# EAGLE schematic steering_wheel_V3.0 (EAGLE 6.3)

## Sheet 1 of 4
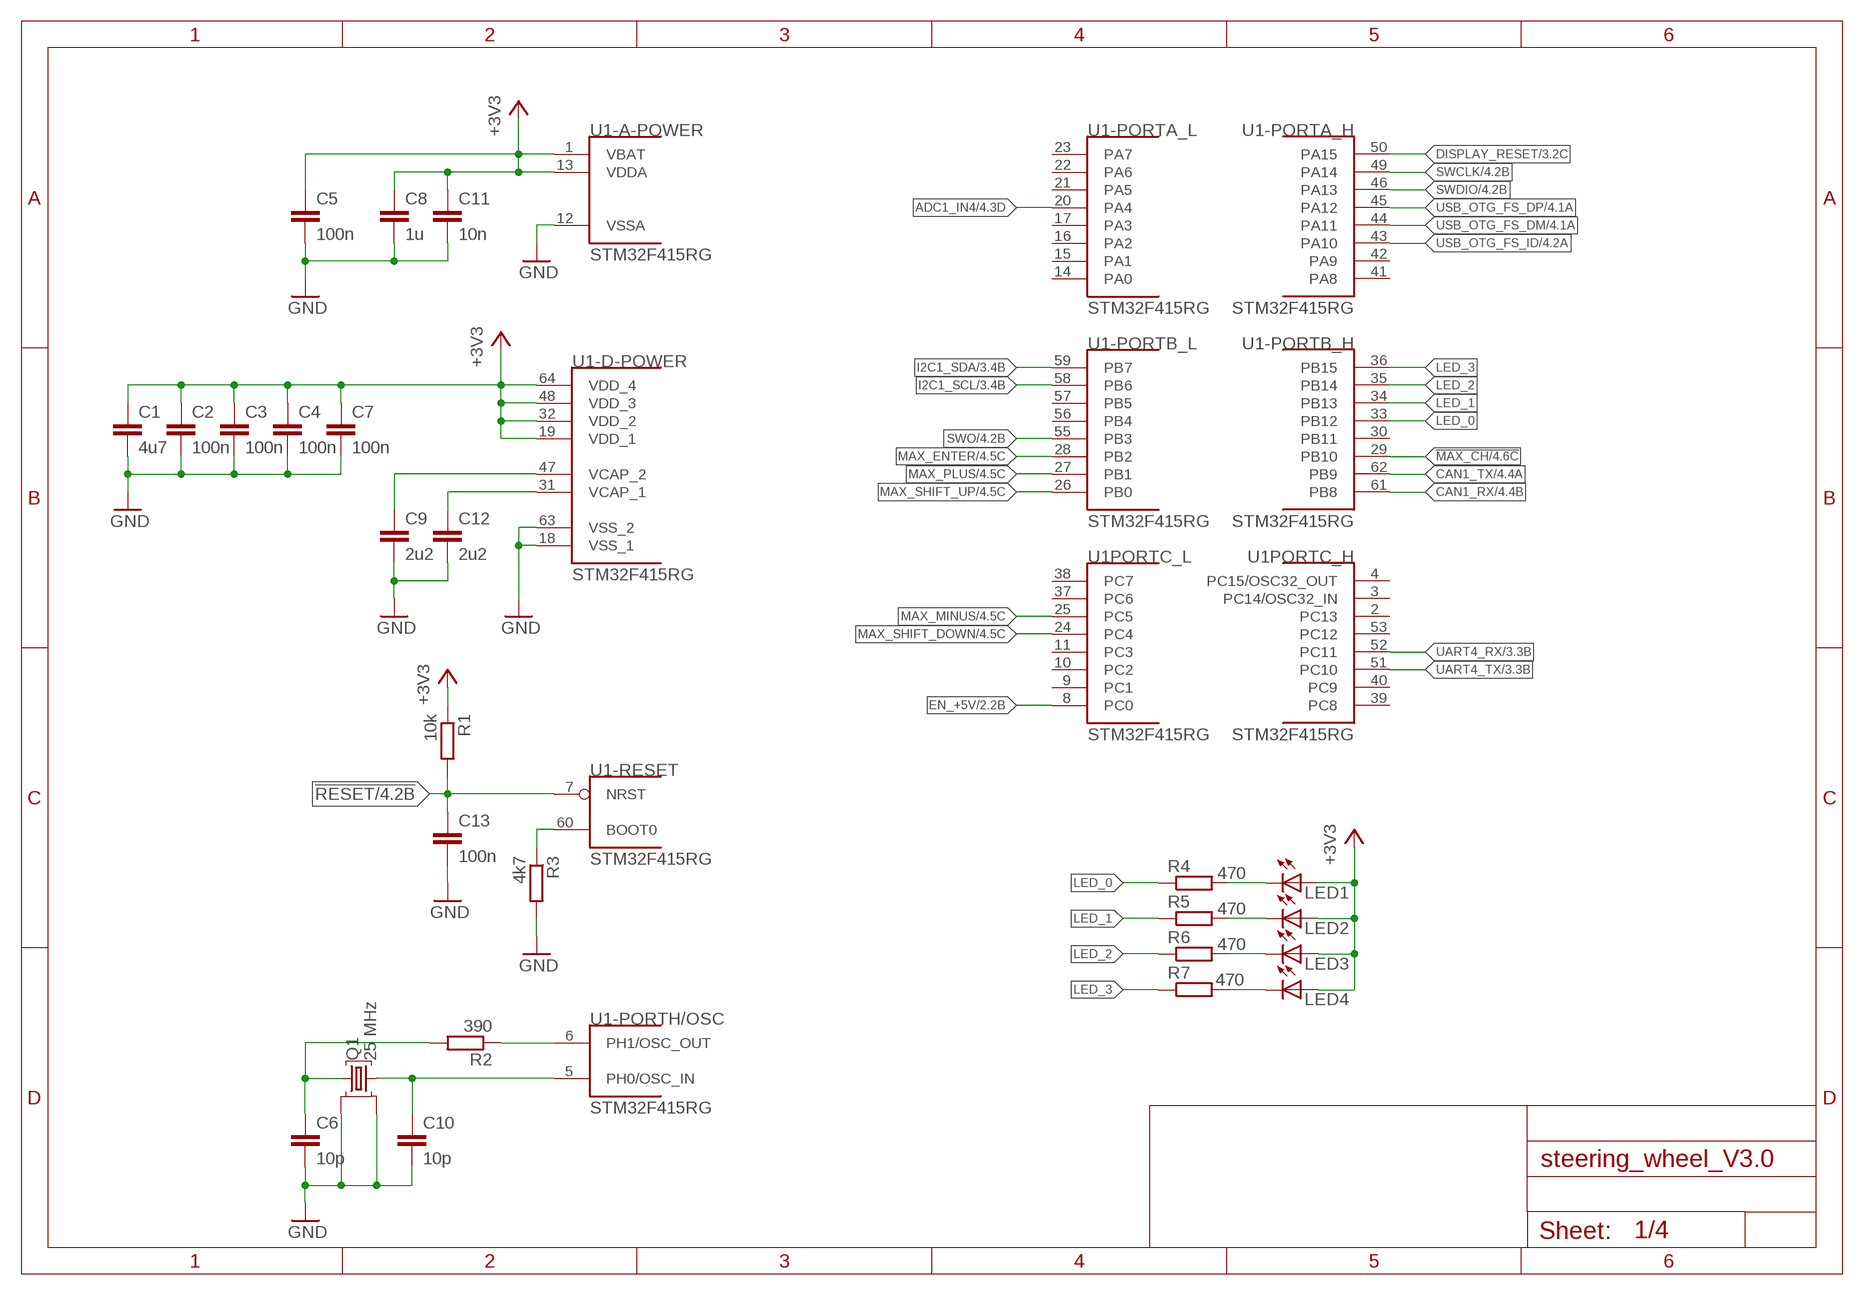
[diagram p0: schematic, sheet 1]

### Parts
C1  4u7  C-EUC0603  [C0603]
C2  100n  C-EUC0603  [C0603]
C3  100n  C-EUC0603  [C0603]
C4  100n  C-EUC0603  [C0603]
C5  100n  C-EUC0603  [C0603]
C6  10p  C-EUC0603  [C0603]
C7  100n  C-EUC0603  [C0603]
C8  1u  C-EUC0603  [C0603]
C9  2u2  C-EUC0603  [C0603]
C10  10p  C-EUC0603  [C0603]
C11  10n  C-EUC0603  [C0603]
C12  2u2  C-EUC0603  [C0603]
C13  100n  C-EUC0603  [C0603]
LED1  LEDCHIPLED_0603  [CHIPLED_0603]
LED2  LEDCHIPLED_0603  [CHIPLED_0603]
LED3  LEDCHIPLED_0603  [CHIPLED_0603]
LED4  LEDCHIPLED_0603  [CHIPLED_0603]
Q1  25 MHz  CRYSTAL2M_CX32  [3.2X2.5MM-SMD]
R1  10k  R-EU_R0603  [R0603]
R2  390  R-EU_R0603  [R0603]
R3  4k7  R-EU_R0603  [R0603]
R4  470  R-EU_R0603  [R0603]
R5  470  R-EU_R0603  [R0603]
R6  470  R-EU_R0603  [R0603]
R7  470  R-EU_R0603  [R0603]
U1  STM32F415RG  [LQFP64]

### Nets
!MAX_CH: U1.29(-PORTB_H:PB10) ; also sheet 4
!RESET: C13.1 R1.2 U1.7(-RESET:NRST) ; also sheet 4
+3V3: C1.1 C2.1 C3.1 C4.1 C5.1 C7.1 C8.1 C11.1 LED1.A LED2.A LED3.A LED4.A R1.1 U1.1(-A-POWER:VBAT) U1.13(-A-POWER:VDDA) U1.19(-D-POWER:VDD_1) U1.32(-D-POWER:VDD_2) U1.48(-D-POWER:VDD_3) U1.64(-D-POWER:VDD_4) ; also sheet 2,3,4
ADC1_IN4: U1.20(-PORTA_L:PA4) ; also sheet 4
CAN1_RX: U1.61(-PORTB_H:PB8) ; also sheet 4
CAN1_TX: U1.62(-PORTB_H:PB9) ; also sheet 4
DISPLAY_RESET: U1.50(-PORTA_H:PA15) ; also sheet 3
EN_+5V: U1.8(PORTC_L:PC0) ; also sheet 2
GND: C1.2 C2.2 C3.2 C4.2 C5.2 C6.2 C7.2 C8.2 C9.2 C10.2 C11.2 C12.2 C13.2 Q1.2(GND1) Q1.4(GND2) R3.2 U1.12(-A-POWER:VSSA) U1.18(-D-POWER:VSS_1) U1.63(-D-POWER:VSS_2) ; also sheet 2,3,4
I2C1_SCL: U1.58(-PORTB_L:PB6) ; also sheet 3
I2C1_SDA: U1.59(-PORTB_L:PB7) ; also sheet 3
LED_0: R4.1 U1.33(-PORTB_H:PB12)
LED_1: R5.1 U1.34(-PORTB_H:PB13)
LED_2: R6.1 U1.35(-PORTB_H:PB14)
LED_3: R7.1 U1.36(-PORTB_H:PB15)
MAX_ENTER: U1.28(-PORTB_L:PB2) ; also sheet 4
MAX_MINUS: U1.25(PORTC_L:PC5) ; also sheet 4
MAX_PLUS: U1.27(-PORTB_L:PB1) ; also sheet 4
MAX_SHIFT_DOWN: U1.24(PORTC_L:PC4) ; also sheet 4
MAX_SHIFT_UP: U1.26(-PORTB_L:PB0) ; also sheet 4
N$1: C9.1 U1.47(-D-POWER:VCAP_2)
N$2: C12.1 U1.31(-D-POWER:VCAP_1)
N$3: R2.1 U1.6(-PORTH/OSC:PH1/OSC_OUT)
N$4: C10.1 Q1.3(Q2) U1.5(-PORTH/OSC:PH0/OSC_IN)
N$5: LED4.C R7.2
N$6: R3.1 U1.60(-RESET:BOOT0)
N$11: LED2.C R5.2
N$12: LED3.C R6.2
N$24: C6.1 Q1.1(Q1) R2.2
N$27: LED1.C R4.2
SWCLK: U1.49(-PORTA_H:PA14) ; also sheet 4
SWDIO: U1.46(-PORTA_H:PA13) ; also sheet 4
SWO: U1.55(-PORTB_L:PB3) ; also sheet 4
UART4_RX: U1.52(PORTC_H:PC11) ; also sheet 3
UART4_TX: U1.51(PORTC_H:PC10) ; also sheet 3
USB_OTG_FS_DM: U1.44(-PORTA_H:PA11) ; also sheet 4
USB_OTG_FS_DP: U1.45(-PORTA_H:PA12) ; also sheet 4
USB_OTG_FS_ID: U1.43(-PORTA_H:PA10) ; also sheet 4
Unconnected: U1.2(PORTC_H:PC13) U1.3(PORTC_H:PC14/OSC32_IN) U1.4(PORTC_H:PC15/OSC32_OUT) U1.9(PORTC_L:PC1) U1.10(PORTC_L:PC2) U1.11(PORTC_L:PC3) U1.14(-PORTA_L:PA0) U1.15(-PORTA_L:PA1) U1.16(-PORTA_L:PA2) U1.17(-PORTA_L:PA3) U1.21(-PORTA_L:PA5) U1.22(-PORTA_L:PA6) U1.23(-PORTA_L:PA7) U1.30(-PORTB_H:PB11) U1.37(PORTC_L:PC6) U1.38(PORTC_L:PC7) U1.39(PORTC_H:PC8) U1.40(PORTC_H:PC9) U1.41(-PORTA_H:PA8) U1.42(-PORTA_H:PA9) U1.53(PORTC_H:PC12) U1.54(-PORTD:PD2) U1.56(-PORTB_L:PB4) U1.57(-PORTB_L:PB5)

## Sheet 2 of 4
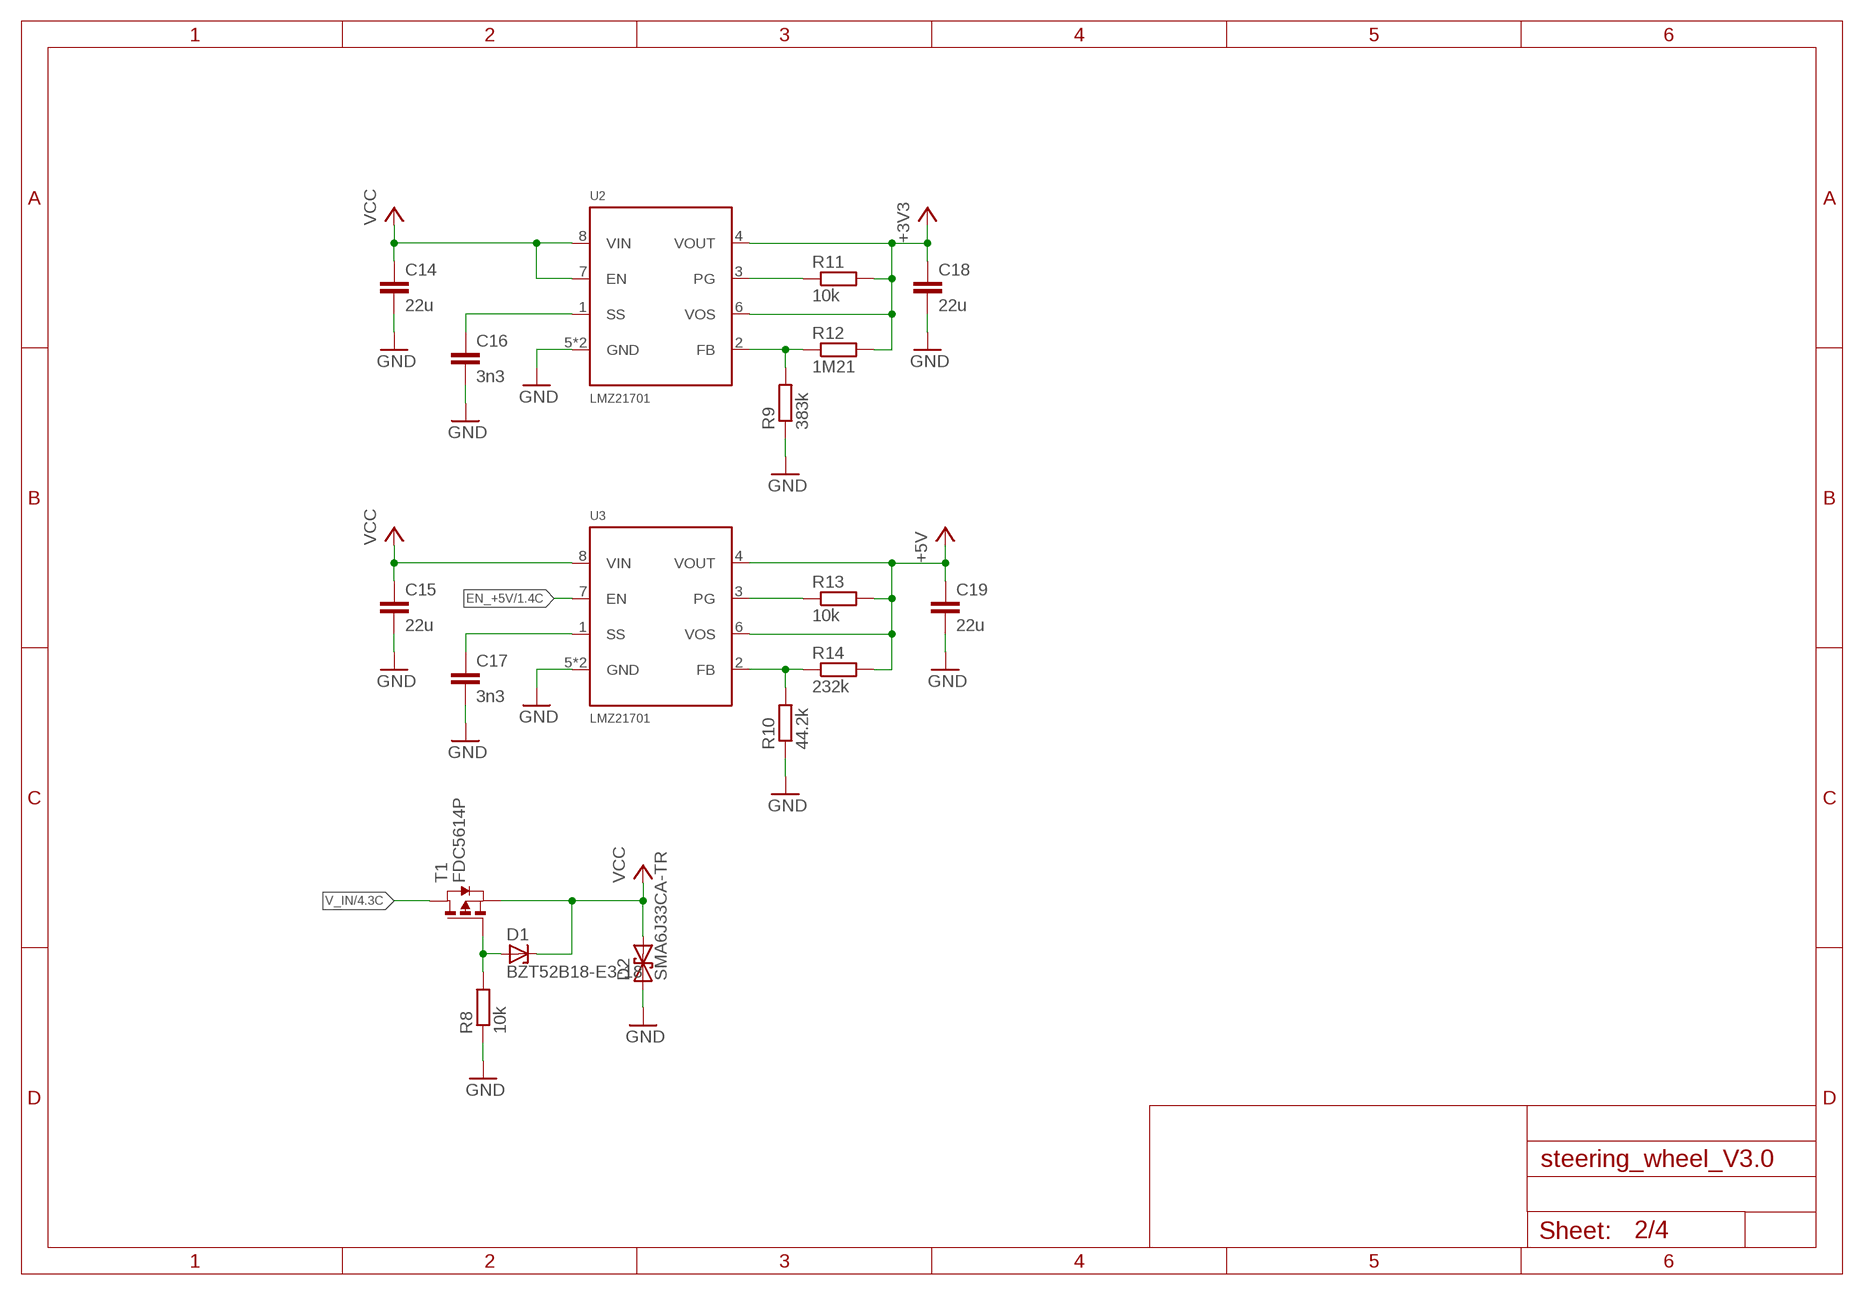
[diagram p1: schematic, sheet 2]

### Parts
C14  22u  C-EUC1210  [C1210]
C15  22u  C-EUC1210  [C1210]
C16  3n3  C-EUC0603  [C0603]
C17  3n3  C-EUC0603  [C0603]
C18  22u  C-EUC1210  [C1210]
C19  22u  C-EUC1210  [C1210]
D1  BZT52B18-E3-18  ZENER_SOD123  [SOD123F]
D2  SMA6J33CA-TR  [DO214AC]
R8  10k  R-EU_R0603  [R0603]
R9  383k  R-EU_R0603  [R0603]
R10  44.2k  R-EU_R0603  [R0603]
R11  10k  R-EU_R0603  [R0603]
R12  1M21  R-EU_R0603  [R0603]
R13  10k  R-EU_R0603  [R0603]
R14  232k  R-EU_R0603  [R0603]
T1  FDC5614P  [SSOT6]
U2  LMZ21701  [SIL0008E]
U3  LMZ21701  [SIL0008E]

### Nets
+3V3: C18.1 R11.2 R12.2 U2.4(VOUT) U2.6(VOS) ; also sheet 1,3,4
+5V: C19.1 R13.2 R14.2 U3.4(VOUT) U3.6(VOS) ; also sheet 4
EN_+5V: U3.7(EN) ; also sheet 1
GND: C14.2 C15.2 C16.2 C17.2 C18.2 C19.2 D2.A R8.1 R9.1 R10.1 U2.5(GND) U2.PAD(GND) U3.5(GND) U3.PAD(GND) ; also sheet 1,3,4
N$14: D1.A R8.2 T1.3(G)
N$38: C16.1 U2.1(SS)
N$39: C17.1 U3.1(SS)
N$40: R13.1 U3.3(PG)
N$41: R11.1 U2.3(PG)
N$42: R9.2 R12.1 U2.2(FB)
N$43: R10.2 R14.1 U3.2(FB)
V_IN: T1.1(D) T1.2(D) T1.5(D) T1.6(D) ; also sheet 4
VCC: C14.1 C15.1 D1.C D2.C T1.4(S) U2.7(EN) U2.8(VIN) U3.8(VIN)

## Sheet 3 of 4
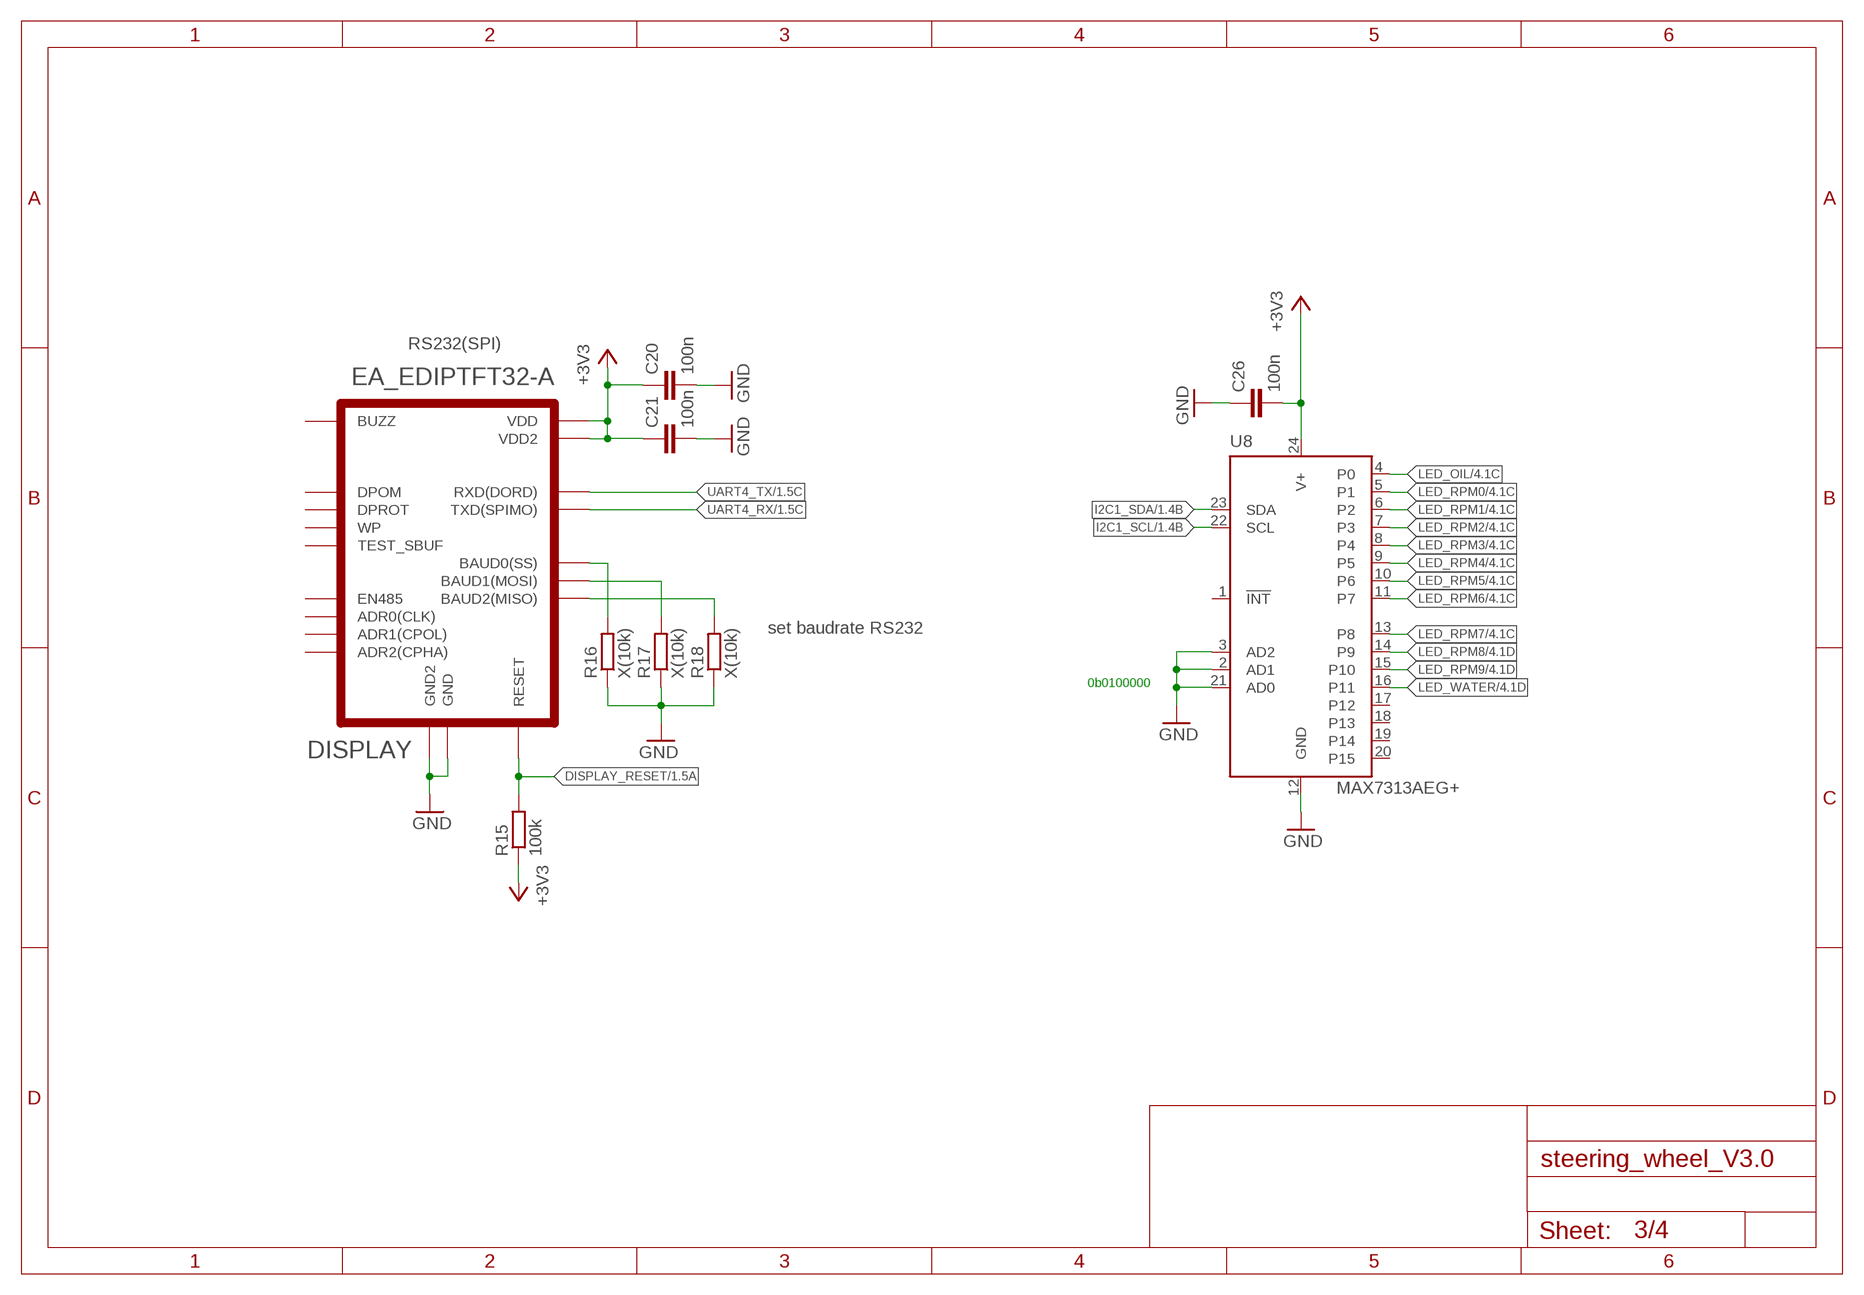
[diagram p2: schematic, sheet 3]

### Parts
C20  100n  C-EUC0603  [C0603]
C21  100n  C-EUC0603  [C0603]
C26  100n  C-EUC0603  [C0603]
DISPLAY  EA_EDIPTFT32-A  EA_EDIPTFT32-A-SR232  [EDIPTFT32-A]
R15  100k  R-EU_R0603  [R0603]
R16  X(10k)  R-EU_R0603  [R0603]
R17  X(10k)  R-EU_R0603  [R0603]
R18  X(10k)  R-EU_R0603  [R0603]
U8  MAX7313AEG+  [QSOP-24]

### Nets
+3V3: C20.1 C21.1 C26.2 DISPLAY.P$2(VDD) DISPLAY.P$22(VDD2) R15.1 U8.24(V+) ; also sheet 1,2,4
DISPLAY_RESET: DISPLAY.P$5(RESET) R15.2 ; also sheet 1
GND: C20.2 C21.2 C26.1 DISPLAY.P$1(GND) DISPLAY.P$21(GND2) R16.1 R17.1 R18.1 U8.2(AD1) U8.3(AD2) U8.12(GND) U8.21(AD0) ; also sheet 1,2,4
I2C1_SCL: U8.22(SCL) ; also sheet 1
I2C1_SDA: U8.23(SDA) ; also sheet 1
LED_OIL: U8.4(P0) ; also sheet 4
LED_RPM0: U8.5(P1) ; also sheet 4
LED_RPM1: U8.6(P2) ; also sheet 4
LED_RPM2: U8.7(P3) ; also sheet 4
LED_RPM3: U8.8(P4) ; also sheet 4
LED_RPM4: U8.9(P5) ; also sheet 4
LED_RPM5: U8.10(P6) ; also sheet 4
LED_RPM6: U8.11(P7) ; also sheet 4
LED_RPM7: U8.13(P8) ; also sheet 4
LED_RPM8: U8.14(P9) ; also sheet 4
LED_RPM9: U8.15(P10) ; also sheet 4
LED_WATER: U8.16(P11) ; also sheet 4
N$8: DISPLAY.P$8(BAUD2(MISO)) R18.2
N$10: DISPLAY.P$7(BAUD1(MOSI)) R17.2
N$13: DISPLAY.P$6(BAUD0(SS)) R16.2
UART4_RX: DISPLAY.P$11(TXD(SPIMO)) ; also sheet 1
UART4_TX: DISPLAY.P$10(RXD(DORD)) ; also sheet 1
Unconnected: DISPLAY.P$9(ADR0(CLK)) DISPLAY.P$12(EN485) DISPLAY.P$13(DPOM) DISPLAY.P$14(ADR1(CPOL)) DISPLAY.P$15(ADR2(CPHA)) DISPLAY.P$16(BUZZ) DISPLAY.P$17(DPROT) DISPLAY.P$19(WP) DISPLAY.P$20(TEST_SBUF) U8.1(!INT) U8.17(P12) U8.18(P13) U8.19(P14) U8.20(P15)

### Notes on the sheet
- set baudrate RS232
- 0b0100000

## Sheet 4 of 4
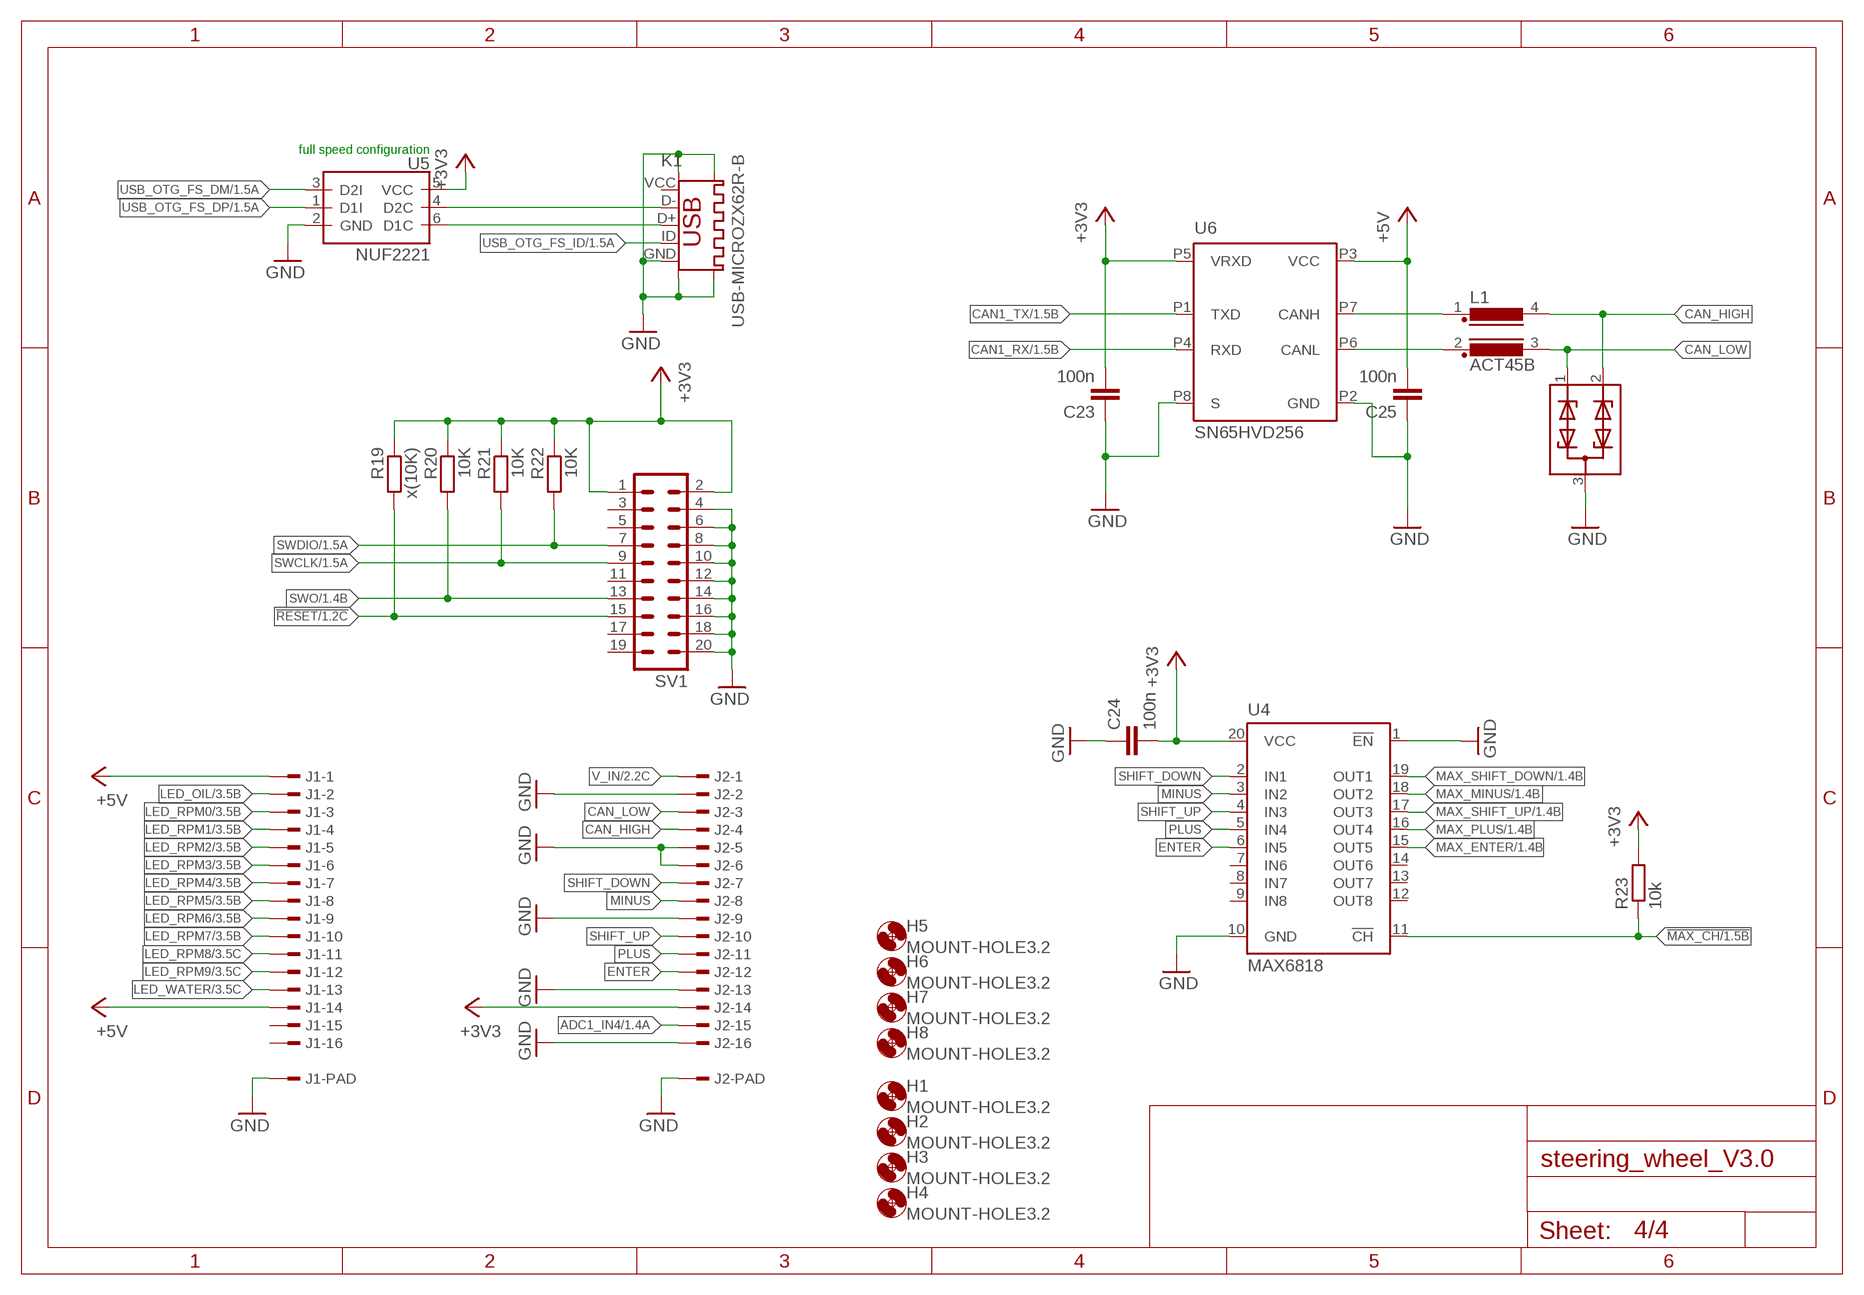
[diagram p3: schematic, sheet 4]

### Parts
C23  100n  C-EUC0603  [C0603]
C24  100n  C-EUC0603  [C0603]
C25  100n  C-EUC0603  [C0603]
D3  PESD1CAN-U  [SOT-323]
H1  MOUNT-HOLE3.2  [3,2]
H2  MOUNT-HOLE3.2  [3,2]
H3  MOUNT-HOLE3.2  [3,2]
H4  MOUNT-HOLE3.2  [3,2]
H5  MOUNT-HOLE3.2  [3,2]
H6  MOUNT-HOLE3.2  [3,2]
H7  MOUNT-HOLE3.2  [3,2]
H8  MOUNT-HOLE3.2  [3,2]
J1  1-292227-6  [1-292227-6]
J2  1-292227-6  [1-292227-6]
K1  USB-MICROZX62R-B  [ZX62R-B]
L1  ACT45B  [ACT45B]
R19  x(10K)  R-EU_R0603  [R0603]
R20  10K  R-EU_R0603  [R0603]
R21  10K  R-EU_R0603  [R0603]
R22  10K  R-EU_R0603  [R0603]
R23  10k  R-EU_R0603  [R0603]
SV1  ML20  [ML20]
U4  MAX6818  [SSOP-20]
U5  NUF2221  [SOT363]
U6  SN65HVD256  [SOIC8]

### Nets
!MAX_CH: R23.1 U4.11(!CH) ; also sheet 1
!RESET: R19.2 SV1.15 ; also sheet 1
+3V3: C23.2 C24.2 J2.14 R19.1 R20.1 R21.1 R22.1 R23.2 SV1.1 SV1.2 U4.20(VCC) U5.5(VCC) U6.P5(VRXD) ; also sheet 1,2,3
+5V: C25.2 J1.1 J1.14 U6.P3(VCC) ; also sheet 2
ADC1_IN4: J2.15 ; also sheet 1
CAN1_RX: U6.P4(RXD) ; also sheet 1
CAN1_TX: U6.P1(TXD) ; also sheet 1
CAN_HIGH: D3.2 J2.4 L1.4
CAN_LOW: D3.1 J2.3 L1.3
ENTER: J2.12 U4.6(IN5)
GND: C23.1 C24.1 C25.1 D3.3 J1.PAD1 J1.PAD2 J2.2 J2.5 J2.6 J2.9 J2.13 J2.16 J2.PAD1 J2.PAD2 K1.GND K1.P$6(GND3) K1.P$7(GND4) K1.P$8(GND1) K1.P$9(GND2) SV1.4 SV1.6 SV1.8 SV1.10 SV1.12 SV1.14 SV1.16 SV1.18 SV1.20 U4.1(!EN) U4.10(GND) U5.2(GND) U6.P2(GND) U6.P8(S) ; also sheet 1,2,3
LED_OIL: J1.2 ; also sheet 3
LED_RPM0: J1.3 ; also sheet 3
LED_RPM1: J1.4 ; also sheet 3
LED_RPM2: J1.5 ; also sheet 3
LED_RPM3: J1.6 ; also sheet 3
LED_RPM4: J1.7 ; also sheet 3
LED_RPM5: J1.8 ; also sheet 3
LED_RPM6: J1.9 ; also sheet 3
LED_RPM7: J1.10 ; also sheet 3
LED_RPM8: J1.11 ; also sheet 3
LED_RPM9: J1.12 ; also sheet 3
LED_WATER: J1.13 ; also sheet 3
MAX_ENTER: U4.15(OUT5) ; also sheet 1
MAX_MINUS: U4.18(OUT2) ; also sheet 1
MAX_PLUS: U4.16(OUT4) ; also sheet 1
MAX_SHIFT_DOWN: U4.19(OUT1) ; also sheet 1
MAX_SHIFT_UP: U4.17(OUT3) ; also sheet 1
MINUS: J2.8 U4.3(IN2)
N$47: L1.1 U6.P7(CANH)
N$66: L1.2 U6.P6(CANL)
PLUS: J2.11 U4.5(IN4)
SHIFT_DOWN: J2.7 U4.2(IN1)
SHIFT_UP: J2.10 U4.4(IN3)
SWCLK: R21.2 SV1.9 ; also sheet 1
SWDIO: R22.2 SV1.7 ; also sheet 1
SWO: R20.2 SV1.13 ; also sheet 1
USB_DM: K1.D- U5.4(D2C)
USB_DP: K1.D+ U5.6(D1C)
USB_OTG_FS_DM: U5.3(D2I) ; also sheet 1
USB_OTG_FS_DP: U5.1(D1I) ; also sheet 1
USB_OTG_FS_ID: K1.ID ; also sheet 1
V_IN: J2.1 ; also sheet 2
Unconnected: J1.15 J1.16 K1.VCC SV1.3 SV1.5 SV1.11 SV1.17 SV1.19 U4.7(IN6) U4.8(IN7) U4.9(IN8) U4.12(OUT8) U4.13(OUT7) U4.14(OUT6)

### Notes on the sheet
- full speed configuration

## Library data of the parts
C1-C5 C7-C9 C11 C12 C14-C21 C23-C26 = rcl:C-EU: CAPACITOR, European symbol
C6 C10 C13 = rcl:C-EU: CAPACITOR, European symbol; DISTRIBUTOR: Digikey; OC_DIGIKEY: 445-1769-1-ND; ORDER_CODE: 445-1769-1-ND
D1 = usr_diode:ZENER_SOD123; DISTRIBUTOR: Mouser; OC_MOUSER: 78-BZT52B18-E3-18; ORDER_CODE: 78-BZT52B18-E3-18
D2 = usr_diode:SMA6J33CA-TR; DISTRIBUTOR: Mouser; OC_MOUSER: 511-SMA6J33CA-TR; ORDER_CODE: 511-SMA6J33CA-TR
D3 = usr_nxp:PESD1CAN-U: PESD1CAN-U CAN bus ESD protection diode; DISTRIBUTOR: Digikey; OC_DIGIKEY: 568-10731-1-ND; ORDER_CODE: 568-10731-1-ND
DISPLAY = _TUG Racing Team_:EA_EDIPTFT32-A-SR232
H1-H8 = holes:MOUNT-HOLE: MOUNTING HOLE with drill center marker
J1 J2 = te:1-292227-6: 1.5mm AMP Mini CT Connectors; DISTRIBUTOR: Digikey; OC_DIGIKEY: A99782CT-ND; ORDER_CODE: A99782CT-ND
K1 = usr_hirose-electric:USB-MICRO: Micro B - Reverse (Top mount) Shell SMT Source: http://media.digikey.com/PDF/Data%20Sheets/Hirose%20PDFs/ZX62R-B-5P.pdf; DISTRIBUTOR: Digikey; OC_DIGIKEY: H11574CT-ND; ORDER_CODE: H11574CT-ND
L1 = usr_gerneral:ACT45B: EPCOS - ACT45B common-mode chokes for CAN bus systems, EIA 1812 51 μH, 200 mA; DISTRIBUTOR: Digikey; OC_DIGIKEY: 495-4597-2-ND; ORDER_CODE: 495-4597-2-ND
LED1-LED4 = led:LED: LED OSRAM: - CHIPLED LG R971, LG N971, LY N971, LG Q971, LY Q971, LO R971, LY R971 LH N974, LH R974 LS Q976, LO Q976, LY Q976 LO Q996 - Hyper CHIPLED LW Q18S LB Q993, LB Q99A, LB R99A - SideLED LS A670, LO A670, LY A670, LG A670, LP A670 LB A673, LV A673, LT A673, LW A673 LH A674 LY A675 LS A676, LA A676, LO A676, LY A676, LW A676 LS A679, LY A679, LG A679 - Hyper Micro SIDELED® LS Y876, LA Y876, LO Y876, LY Y876 LT Y87S - SmartLED LW L88C, LW L88S LB L89C, LB L89S, LG L890 LS L89K, LO L89K, LY L89K LS L896, LA L896, LO L896, LY L896 - TOPLED LS T670, LO T670, LY T670, LG T670, LP T670 LSG T670, LSP T670, LSY T670, LOP T670, LYG T670 LG T671, LOG T671, LSG T671 LB T673, LV T673, LT T673, LW T673 LH T674 LS T676, LA T676, LO T676, LY T676, LB T676, LH T676, LSB T676, LW T676 LB T67C, LV T67C, LT T67C, LS T67K, LO T67K, LY T67K, LW E67C LS E67B, LA E67B, LO E67B, LY E67B, LB E67C, LV E67C, LT E67C LW T67C LS T679, LY T679, LG T679 LS T770, LO T770, LY T770, LG T770, LP T770 LB T773, LV T773, LT T773, LW T773 LH T774 LS E675, LA E675, LY E675, LS T675 LS T776, LA T776, LO T776, LY T776, LB T776 LHGB T686 LT T68C, LB T68C - Hyper Mini TOPLED® LB M676 - Mini TOPLED Santana® LG M470 LS M47K, LO M47K, LY M47K Source: http://www.osram.convergy.de LUXEON: - LUMILED® LXK2-PW12-R00, LXK2-PW12-S00, LXK2-PW14-U00, LXK2-PW14-V00 LXK2-PM12-R00, LXK2-PM12-S00, LXK2-PM14-U00 LXK2-PE12-Q00, LXK2-PE12-R00, LXK2-PE12-S00, LXK2-PE14-T00, LXK2-PE14-U00 LXK2-PB12-K00, LXK2-PB12-L00, LXK2-PB12-M00, LXK2-PB14-N00, LXK2-PB14-P00, LXK2-PB14-Q00 LXK2-PR12-L00, LXK2-PR12-M00, LXK2-PR14-Q00, LXK2-PR14-R00 LXK2-PD12-Q00, LXK2-PD12-R00, LXK2-PD12-S00 LXK2-PH12-R00, LXK2-PH12-S00 LXK2-PL12-P00, LXK2-PL12-Q00, LXK2-PL12-R00 Source: www.luxeon.com KINGBRIGHT: KA-3528ASYC Source: www.kingbright.com; ASMT-RA45-AQ502: amber; ASMT-RF45-AQ502: green; ASMT-RJ45-AQ502: orange; ASMT-RR45-AQ502: red
Q1 = usr_crystal:CRYSTAL2M*: Crystal Source: ABM11 Series <http://www.abracon.com/Resonators/ABM11.pdf>; DISTRIBUTOR: Digikey; OC_DIGIKEY: 644-1266-1-ND; ORDER_CODE: 644-1266-1-ND
R1-R3 R9 R11-R13 = rcl:R-EU_: RESISTOR, European symbol; DISTRIBUTOR: Digikey; OC_DIGIKEY: P390AGCT-ND; ORDER_CODE: P390AGCT-ND
R4-R7 R10 R14-R18 R23 = rcl:R-EU_: RESISTOR, European symbol
R8 R19-R22 = rcl:R-EU_: RESISTOR, European symbol; DISTRIBUTOR: Mouser; OC_MOUSER: 71-CRCW0402-10K-E3; ORDER_CODE: 71-CRCW0402-10K-E3
SV1 = con-ml:ML20: HARTING; OC_FARNELL: unknown; OC_NEWARK: unknown
T1 = usr_gerneral:FDC5614P: 60V P-Channel MOSFET Id -3A Vds -60V Vgs -20V; DISTRIBUTOR: Mouser; OC_MOUSER: 512-FDC5614P; ORDER_CODE: 512-FDC5614P
U1 = STMicroelectronics:STM32F415RG; DISTRIBUTOR: Digikey; OC_DIGIKEY: 497-11767-ND; ORDER_CODE: 497-11767-ND
U2 U3 = ti:LMZ2170*: LMZ2170X 1 A SIMPLE SWITCHER® Nano Module with 17 V Maximum Input Voltage; DISTRIBUTOR: RS; ORDER_CODE: 798-1212
U4 = maxim:MAX6818: ±15kV ESD-Protected Octal CMOS Switch Debouncers
U5 = usr_on-semiconductor:NUF2221: USB Upstream Terminator with ESD Protection http://www.onsemi.com/pub_link/Collateral/NUF2221W1T2-D.PDF; DISTRIBUTOR: Digikey; OC_DIGIKEY: NUF2221W1T2GOSCT-ND; ORDER_CODE: NUF2221W1T2GOSCT-ND
U6 = usr_TexasInstruments:SN65HVD256: SN65HVD256 - CAN Transceiver With Fast Loop Times for Highly Loaded Networks has logic and output power supplies!; DISTRIBUTOR: Digikey; OC_DIGIKEY: 296-30093-1-ND; ORDER_CODE: 296-30093-1-ND
U8 = maxim:MAX7313: 16-Port I/O Expander with LED Intensity Control, Interrupt, and Hot-Insertion Protection